# EAGLE board HDMI_RGB_LVDS_fertig_V4 (EAGLE 6.3)
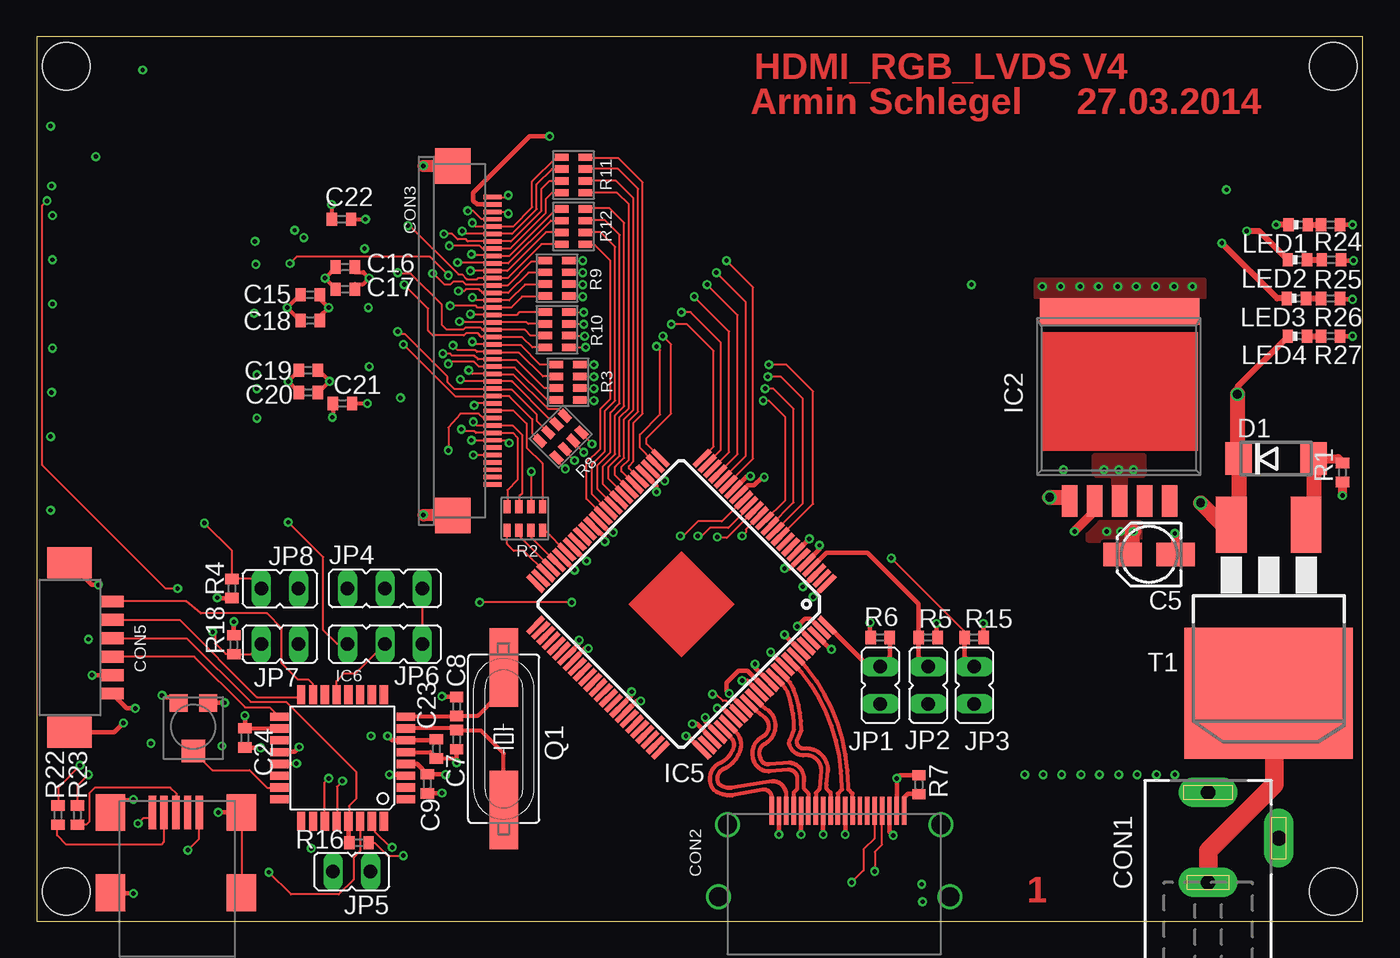
[diagram p6: board, top side]
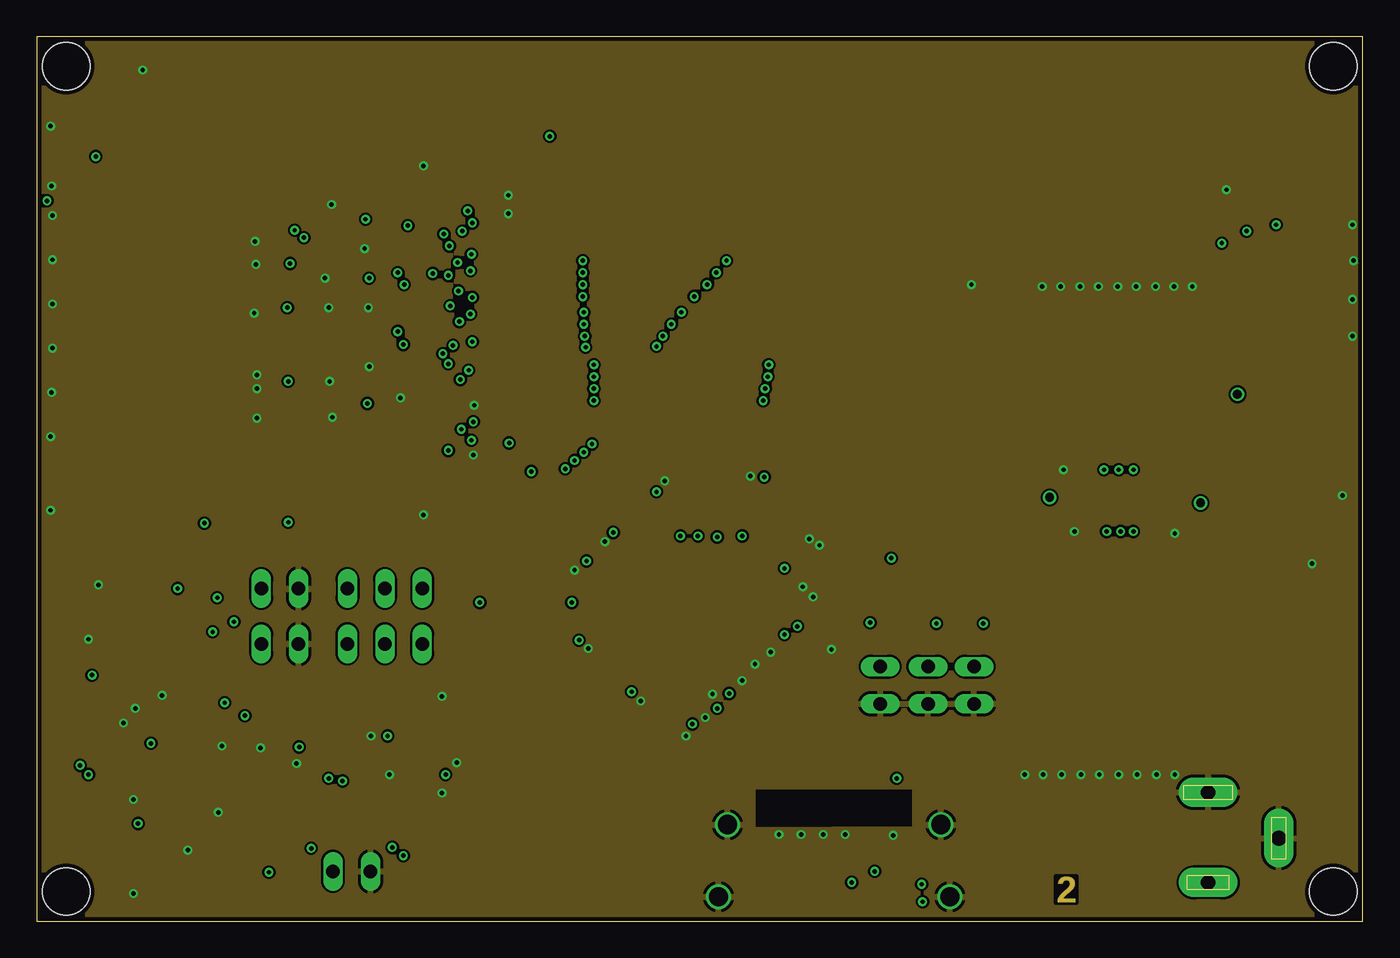
[diagram p7: board, inner layer Route2]
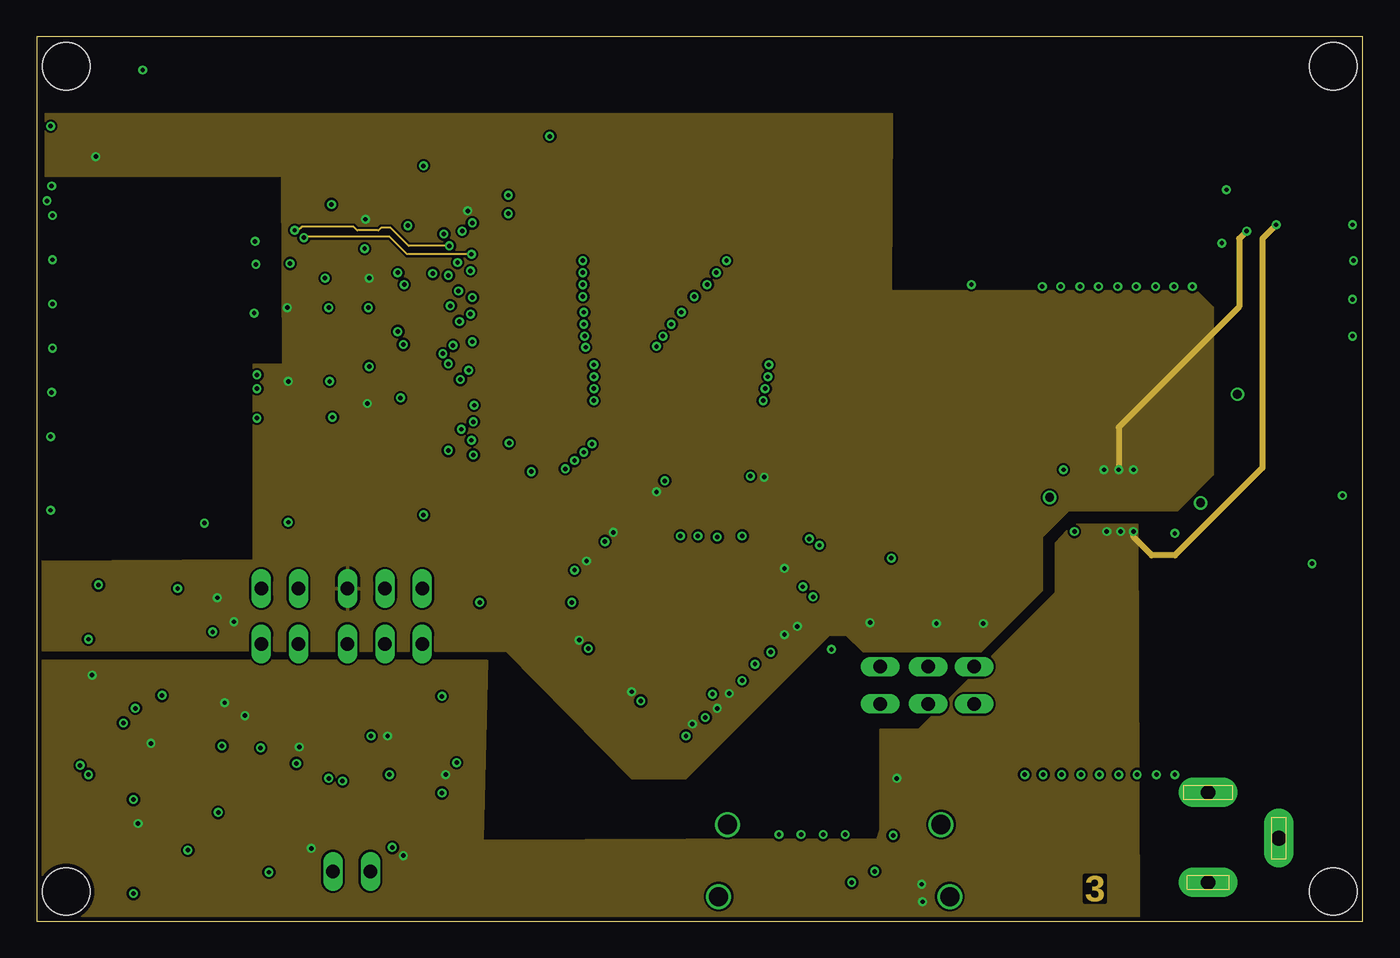
[diagram p8: board, inner layer Route15]
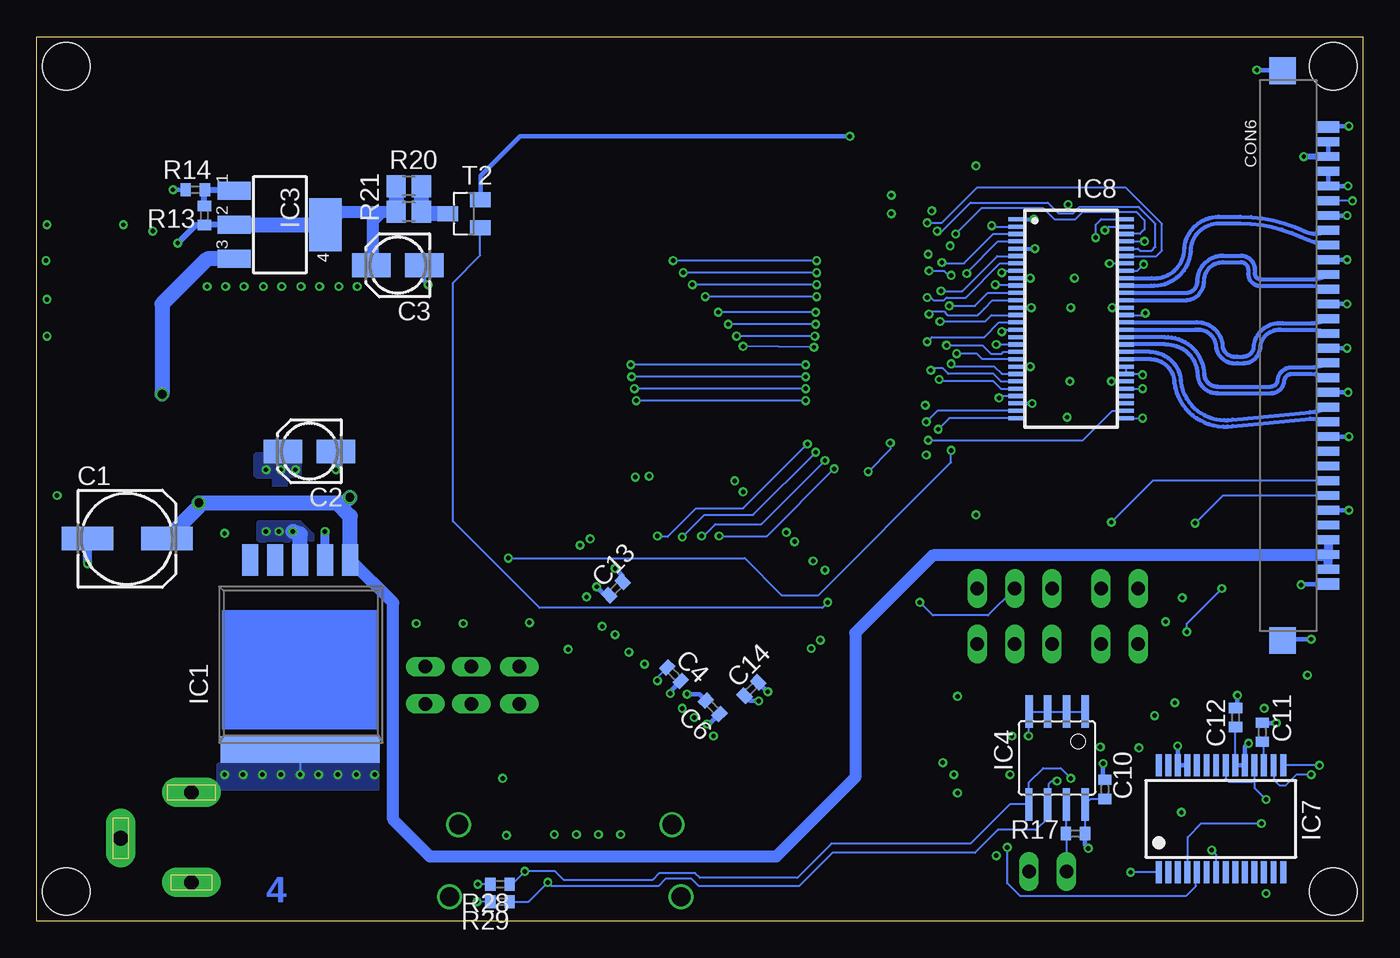
[diagram p9: board, bottom side, seen from below]

Size 90 x 60 mm. Coordinates in mm from the lower left corner, seen from the top.
Outline: 0,0 90,0 90,60 0,60 0,0
Copper layers (1+2*15+16): Top 0.035mm / dielectric 0.38mm / Route2 0.035mm / dielectric 0.71mm / Route15 0.035mm / dielectric 0.38mm / Bottom 0.035mm
Design rules "PCB-POOL Standard_ML4": minimum track width 0.15mm, minimum drill 0.3mm, track to track 0.15mm, track to pad 0.15mm, pad to pad 0.15mm, via to via 0.15mm, smd to smd 0.15mm, copper to edge 0.3mm, drill to drill 0.2mm, minimum pad ring 0.2mm, minimum via ring 0.15mm, stop-mask expansion 0.075mm, vias tented up to drill 0mil, thermal gap 0.2mm
Holes 3.2 mm at 2,2 2,58 88,58 88,2

## Footprints (pad centres in the part's own frame; a part is rotated, then mirrored left to right if it is on the bottom)
C_POL_6X6MM = smd 3.5 x 1.6: + 2.7,0.07; - -2.7,0.07
C_POL_4X4MM = smd 2.6 x 1.6: + 1.8,0; - -1.8,0
C0402 = smd 0.7 x 0.9: 1 -0.65,0; 2 0.65,0
KLDX-0202-A-LT = drill 1 pad 2 long: 1 3.1,-0.01; 2 0,-4.81; 3 -3,-0.01
FCI-10029449-111RLF = smd 0.3 x 1.9: 1 -4.25,1; 2 -3.75,1; 3 -3.25,1; 4 -2.75,1; 5 -2.25,1; 6 -1.75,1; 7 -1.25,1; 8 -0.75,1; 9 -0.25,1; 10 0.25,1; 11 0.75,1; 12 1.25,1; 13 1.75,1; 14 2.25,1; 15 2.75,1; 16 3.25,1; 17 3.75,1; 18 4.25,1; 19 4.75,1 | drill 1.3: GND@1 -7.25,0.05; GND@2 -7.85,-4.85; GND@3 7.25,0.05; GND@4 7.85,-4.85
XF2M-4015-1A = smd 0.3 x 1.2: 1 -9.75,2.5; 2 -9.25,2.5; 3 -8.75,2.5; 4 -8.25,2.5; 5 -7.75,2.5; 6 -7.25,2.5; 7 -6.75,2.5; 8 -6.25,2.5; 9 -5.75,2.5; 10 -5.25,2.5; 11 -4.75,2.5; 12 -4.25,2.5; 13 -3.75,2.5; 14 -3.25,2.5; 15 -2.75,2.5; 16 -2.25,2.5; 17 -1.75,2.5; 18 -1.25,2.5; 19 -0.75,2.5; 20 -0.25,2.5; 21 0.25,2.5; 22 0.75,2.5; 23 1.25,2.5; 24 1.75,2.5; 25 2.25,2.5; 26 2.75,2.5; 27 3.25,2.5; 28 3.75,2.5; 29 4.25,2.5; 30 4.75,2.5; 31 5.25,2.5; 32 5.75,2.5; 33 6.25,2.5; 34 6.75,2.5; 35 7.25,2.5; 36 7.75,2.5; 37 8.25,2.5; 38 8.75,2.5; 39 9.25,2.5; 40 9.75,2.5 | smd 2.4 x 2.4: GND@1 -11.85,-0.2; GND@2 11.85,-0.2
FCI-10033526-N3212LF = smd 0.5 x 2.25: 1 -1.6,0.8; 2 -0.8,0.8; 3 0,0.8; 4 0.8,0.8; 5 1.6,0.8 | smd 2 x 2.5: GND@1 -4.45,0.8; GND@2 -4.45,-4.65; GND@3 4.45,-4.65; GND@4 4.45,0.8
MOLEX-53261-0671 = smd 0.8 x 1.6: 1 -3.125,2.55; 2 -1.875,2.55; 3 -0.625,2.55; 4 0.625,2.55; 5 1.875,2.55; 6 3.125,2.55 | smd 2.1 x 3: GND@1 -5.75,-0.35; GND@2 5.75,-0.35
FI-X30SSLA-HF = smd 0.6 x 1.5: 1 -14.5,2.65; 2 -13.5,2.65; 3 -12.5,2.65; 4 -11.5,2.65; 5 -10.5,2.65; 6 -9.5,2.65; 7 -8.5,2.65; 8 -7.5,2.65; 9 -6.5,2.65; 10 -5.5,2.65; 11 -4.5,2.65; 12 -3.5,2.65; 13 -2.5,2.65; 14 -1.5,2.65; 15 -0.5,2.65; 16 0.5,2.65; 17 1.5,2.65; 18 2.5,2.65; 19 3.5,2.65; 20 4.5,2.65; 21 5.5,2.65; 22 6.5,2.65; 23 7.5,2.65; 24 8.5,2.65; 25 9.5,2.65; 26 10.5,2.65; 27 11.5,2.65; 28 12.5,2.65; 29 13.5,2.65; 30 14.5,2.65 | smd 0.8 x 1.5: GND@1 -15.5,2.65; GND@2 15.5,2.65 | smd 1.8 x 1.8: GND@3 -19.325,-0.45; GND@4 19.325,-0.45
DO214A = smd 1.8 x 2.2: A 2.55,0; C -2.55,0
TO263-5 = smd 1.07 x 2.16: 1 3.4,7; 2 1.7,7; 3 0,7; 4 -1.7,7; 5 -3.4,7 | smd 10.8 x 1.8: 6 0,-5.87
SOT223 = smd 1.219 x 2.235: 1 -2.311,-3.099; 2 0,-3.099; 3 2.311,-3.099 | smd 3.6 x 2.2: 4 0,3.099
SOIC8 = smd 0.5 x 2.2: 1 -1.905,-3.154; 2 -0.645,-3.154; 3 0.625,-3.154; 4 1.895,-3.154; 5 1.905,3.154; 6 0.635,3.154; 7 -0.635,3.154; 8 -1.905,3.154
HTQFP-100 = smd 1.5 x 0.35: 1 -8,6; 2 -8,5.5; 3 -8,5; 4 -8,4.5; 5 -8,4; 6 -8,3.5; 7 -8,3; 8 -8,2.5; 9 -8,2; 10 -8,1.5; 11 -8,1; 12 -8,0.5; 13 -8,0; 14 -8,-0.5; 15 -8,-1; 16 -8,-1.5; 17 -8,-2; 18 -8,-2.5; 19 -8,-3; 20 -8,-3.5; 21 -8,-4; 22 -8,-4.5; 23 -8,-5; 24 -8,-5.5; 25 -8,-6; 51 8,-6; 52 8,-5.5; 53 8,-5; 54 8,-4.5; 55 8,-4; 56 8,-3.5; 57 8,-3; 58 8,-2.5; 59 8,-2; 60 8,-1.5; 61 8,-1; 62 8,-0.5; 63 8,0; 64 8,0.5; 65 8,1; 66 8,1.5; 67 8,2; 68 8,2.5; 69 8,3; 70 8,3.5; 71 8,4; 72 8,4.5; 73 8,5; 74 8,5.5; 75 8,6 | smd 0.35 x 1.5: 26 -6,-8; 27 -5.5,-8; 28 -5,-8; 29 -4.5,-8; 30 -4,-8; 31 -3.5,-8; 32 -3,-8; 33 -2.5,-8; 34 -2,-8; 35 -1.5,-8; 36 -1,-8; 37 -0.5,-8; 38 0,-8; 39 0.5,-8; 40 1,-8; 41 1.5,-8; 42 2,-8; 43 2.5,-8; 44 3,-8; 45 3.5,-8; 46 4,-8; 47 4.5,-8; 48 5,-8; 49 5.5,-8; 50 6,-8; 76 6,8; 77 5.5,8; 78 5,8; 79 4.5,8; 80 4,8; 81 3.5,8; 82 3,8; 83 2.5,8; 84 2,8; 85 1.5,8; 86 1,8; 87 0.5,8; 88 0,8; 89 -0.5,8; 90 -1,8; 91 -1.5,8; 92 -2,8; 93 -2.5,8; 94 -3,8; 95 -3.5,8; 96 -4,8; 97 -4.5,8; 98 -5,8; 99 -5.5,8; 100 -6,8
TQFP32 = smd 1.27 x 0.559: 1 -4.293,2.8; 2 -4.293,2; 3 -4.293,1.2; 4 -4.293,0.4; 5 -4.293,-0.4; 6 -4.293,-1.2; 7 -4.293,-2; 8 -4.293,-2.8; 17 4.293,-2.8; 18 4.293,-2; 19 4.293,-1.2; 20 4.293,-0.4; 21 4.293,0.4; 22 4.293,1.2; 23 4.293,2; 24 4.293,2.8 | smd 0.559 x 1.27: 9 -2.8,-4.293; 10 -2,-4.293; 11 -1.2,-4.293; 12 -0.4,-4.293; 13 0.4,-4.293; 14 1.2,-4.293; 15 2,-4.293; 16 2.8,-4.293; 25 2.8,4.293; 26 2,4.293; 27 1.2,4.293; 28 0.4,4.293; 29 -0.4,4.293; 30 -1.2,4.293; 31 -2,4.293; 32 -2.8,4.293
SSOP28 = smd 0.4 x 1.5: 1 -4.225,-3.625; 2 -3.575,-3.625; 3 -2.925,-3.625; 4 -2.275,-3.625; 5 -1.625,-3.625; 6 -0.975,-3.625; 7 -0.325,-3.625; 8 0.325,-3.625; 9 0.975,-3.625; 10 1.625,-3.625; 11 2.275,-3.625; 12 2.925,-3.625; 13 3.575,-3.625; 14 4.225,-3.625; 15 4.225,3.625; 16 3.575,3.625; 17 2.925,3.625; 18 2.275,3.625; 19 1.625,3.625; 20 0.975,3.625; 21 0.325,3.625; 22 -0.325,3.625; 23 -0.975,3.625; 24 -1.625,3.625; 25 -2.275,3.625; 26 -2.925,3.625; 27 -3.575,3.625; 28 -4.225,3.625
TSSOP-56 = smd 0.28 x 1: 1 -6.75,-3.85; 2 -6.25,-3.85; 3 -5.75,-3.85; 4 -5.25,-3.85; 5 -4.75,-3.85; 6 -4.25,-3.85; 7 -3.75,-3.85; 8 -3.25,-3.85; 9 -2.75,-3.85; 10 -2.25,-3.85; 11 -1.75,-3.85; 12 -1.25,-3.85; 13 -0.75,-3.85; 14 -0.25,-3.85; 15 0.25,-3.85; 16 0.75,-3.85; 17 1.25,-3.85; 18 1.75,-3.85; 19 2.25,-3.85; 20 2.75,-3.85; 21 3.25,-3.85; 22 3.75,-3.85; 23 4.25,-3.85; 24 4.75,-3.85; 25 5.25,-3.85; 26 5.75,-3.85; 27 6.25,-3.85; 28 6.75,-3.85; 29 6.75,3.65; 30 6.25,3.65; 31 5.75,3.65; 32 5.25,3.65; 33 4.75,3.65; 34 4.25,3.65; 35 3.75,3.65; 36 3.25,3.65; 37 2.75,3.65; 38 2.25,3.65; 39 1.75,3.65; 40 1.25,3.65; 41 0.75,3.65; 42 0.25,3.65; 43 -0.25,3.65; 44 -0.75,3.65; 45 -1.25,3.65; 46 -1.75,3.65; 47 -2.25,3.65; 48 -2.75,3.65; 49 -3.25,3.65; 50 -3.75,3.65; 51 -4.25,3.65; 52 -4.75,3.65; 53 -5.25,3.65; 54 -5.75,3.65; 55 -6.25,3.65; 56 -6.75,3.65
JUMPER2_THROUGHHOLE = drill 0.914 long: 1 0,-1.27; 2 0,1.27
JUMPER3_THROUGHHOLE = drill 0.914 long: 1 0,-2.54; 2 0,0; 3 0,2.54
LED0402 = smd 0.7 x 0.9: A -0.65,0; C 0.65,0
HC49/USSM = smd 5.334 x 1.93: 1 -4.826,0; 2 4.826,0
R0402 = smd 0.7 x 0.9: 1 -0.65,0; 2 0.65,0
R-ARRAY-4X0603 = smd 0.9 x 0.5: 1M -0.8,1.2; 1P 0.8,1.2; 2M -0.8,0.4; 2P 0.8,0.4; 3M -0.8,-0.4; 3P 0.8,-0.4; 4M -0.8,-1.2; 4P 0.8,-1.2
35WR5KLFTR = smd 1.2 x 1.2: 1 -1.6,1; 3 -1.6,-1 | smd 1.5 x 1.6: 2 1.65,0
R2512 = smd 1.3 x 1.5: 1 -0.85,0; 2 0.85,0
D2PAK = smd 2.083 x 3.81: 1 -2.54,-8.89; 3 2.54,-8.89 | smd 11.43 x 8.89: 2 0,2.54
SOT23 = smd 1 x 1.4: 1 -0.95,-1.1; 2 0.95,-1.1; 3 0,1.1

## Placement (x,y rotation side)
C1  100u  [C_POL_6X6MM]  83.88,25.88 0 bottom
C2  10u  [C_POL_4X4MM]  71.5,31.88 180 bottom
C3  10u  [C_POL_4X4MM]  65.5,44.5 180 bottom
C4  100n  [C0402]  46.75,16.75 315 bottom
C5  10u  [C_POL_4X4MM]  75.5,24.88 180 top
C6  100n  [C0402]  44.12,14.5 315 bottom
C7  22p  [C0402]  28.5,12.31 90 top
C8  22p  [C0402]  28.5,14.56 270 top
C9  100n  [C0402]  26.5,9.31 270 top
C10  100n  [C0402]  17.5,8.94 270 bottom
C11  100n  [C0402]  6.81,12.81 90 bottom
C12  100n  [C0402]  8.62,13.81 90 bottom
C13  100n  [C0402]  50.69,22.56 45 bottom
C14  100n  [C0402]  41.5,15.75 45 bottom
C15  0.01u  [C0402]  18.56,42.5 180 top
C16  0.1u  [C0402]  20.94,44.38 0 top
C17  0.01u  [C0402]  20.94,42.88 0 top
C18  0.1u  [C0402]  18.56,40.75 180 top
C19  0.01u  [C0402]  18.44,37.38 180 top
C20  0.1u  [C0402]  18.44,35.88 180 top
C21  0.01u  [C0402]  20.75,35.12 0 top
C22  0.01u  [C0402]  20.69,47.62 0 top
C23  100n  [C0402]  27.12,11.69 270 top
C24  100n  [C0402]  14.12,12.44 270 top
CON1  KLDX-0202-A-LT  [KLDX-0202-A-LT]  79.5,5.62 90 top
CON2  FCI-10029449-111RLF  [FCI-10029449-111RLF]  54.12,6.5 0 top
CON3  XF2M-4015-1A  [XF2M-4015-1A]  28.44,39.38 270 top
CON4  FCI-10033526-N3212LF  [FCI-10033526-N3212LF]  9.44,6.56 0 top
CON5  MOLEX-53261-0671  [MOLEX-53261-0671]  2.56,18.56 270 top
CON6  FI-X30SSLA-HF  [FI-X30SSLA-HF]  5,38.38 270 bottom
D1  BZG03C15TR3  [DO214A]  84.12,31.38 0 top
IC1  WPMDL1300501BD  [TO263-5]  72.12,17.5 0 bottom
IC2  WPMDL1300331BD  [TO263-5]  73.5,35.5 180 top
IC3  TLV1117CDCYR  [SOT223]  73.5,47.25 270 bottom
IC4  AT24C01C-SSHM-B  [SOIC8]  20.75,11.06 180 bottom
IC5  TFP401APZP  [HTQFP-100]  43.75,21.5 225 top
IC6  ATMEGA48A-AU  [TQFP32]  20.75,11.06 180 top
IC7  FT232RL  [SSOP28]  9.62,6.94 0 bottom
IC8  SN75LVDS83BDGGR  [TSSOP-56]  19.69,40.88 270 bottom
JP1  JUMPER2  [JUMPER2_THROUGHHOLE]  57.25,16 0 top
JP2  JUMPER2  [JUMPER2_THROUGHHOLE]  60.5,16 0 top
JP3  JUMPER2  [JUMPER2_THROUGHHOLE]  63.62,16 0 top
JP4  JUMPER3  [JUMPER3_THROUGHHOLE]  23.62,22.56 270 top
JP5  [JUMPER2_THROUGHHOLE]  21.38,3.38 90 top
JP6  JUMPER3  [JUMPER3_THROUGHHOLE]  23.62,18.81 90 top
JP7  [JUMPER2_THROUGHHOLE]  16.5,18.81 90 top
JP8  [JUMPER2_THROUGHHOLE]  16.5,22.56 90 top
LED1  [LED0402]  85.62,47.25 180 top
LED2  [LED0402]  85.56,44.88 180 top
LED3  [LED0402]  85.5,42.25 180 top
LED4  [LED0402]  85.56,39.69 180 top
Q1  ATS073ASM-1  [HC49/USSM]  31.69,12.38 270 top
R1  100k  [R0402]  88.62,30.44 90 top
R2  22R  [R-ARRAY-4X0603]  33.12,27.31 90 top
R3  22R  [R-ARRAY-4X0603]  36.06,36.56 180 top
R4  10k  [R0402]  13.25,22.56 270 top
R5  10k  [R0402]  60.5,19.25 0 top
R6  10k  [R0402]  57.25,19.25 180 top
R7  100R  [R0402]  59.88,9.25 90 top
R8  22R  [R-ARRAY-4X0603]  35.56,32.88 135 top
R9  22R  [R-ARRAY-4X0603]  35.31,43.62 180 top
R10  22R  [R-ARRAY-4X0603]  35.31,40.12 180 top
R11  22R  [R-ARRAY-4X0603]  36.44,50.62 180 top
R12  22R  [R-ARRAY-4X0603]  36.44,47.12 180 top
R13  4k7  [R0402]  78.62,47.88 270 bottom
R14  31k4  [R0402]  79.25,49.62 180 bottom
R15  10k  [R0402]  63.62,19.25 0 top
R16  10k  [R0402]  21.88,5.31 180 top
R17  10k  [R0402]  19.5,5.94 0 bottom
R18  10k  [R0402]  13.38,18.75 90 top
R19  10k  [35WR5KLFTR]  10.62,13.19 270 top
R20  140R  [R2512]  64.75,49.88 180 bottom
R21  140R  [R2512]  64.75,48.12 180 bottom
R22  0R  [R0402]  1.44,7.19 90 top
R23  0R  [R0402]  2.75,7.19 90 top
R24  261R  [R0402]  87.81,47.25 180 top
R25  600R  [R0402]  87.88,44.88 180 top
R26  1k5  [R0402]  87.81,42.25 180 top
R27  2k5  [R0402]  87.81,39.69 180 top
R28  10k  [R0402]  58.56,2.5 180 bottom
R29  10k  [R0402]  58.56,1.31 180 bottom
T1  IRF9530NSTRRPBF  [D2PAK]  83.62,18 180 top
T2  IRLML2502TRPBF  [SOT23]  61,48 90 bottom
U$1  FRAME_A3_LANDSCAPE  [FRAME]  0.05,0.06 0 top
U$2  FRAME_A3_LANDSCAPE  [FRAME]  0,0 0 top
U$3  FRAME_A3_LANDSCAPE  [FRAME]  0,0 0 top
U$4  FRAME_A3_LANDSCAPE  [FRAME]  0,0 0 top
U$5  FRAME_A3_LANDSCAPE  [FRAME]  0,0 0 top
U$15  FRAME_A3_LANDSCAPE  [FRAME]  0,0 0 top

## Tracks (layer width: path | path; a pad name or v marks a point on that pad's centre or on a via)
+3V3  (via drill 0.3)
  Top 0.15: C16.2 21.59,44.04 | C17.2 21.59,43.21 | IC5.78 | IC5.67 39.51,14.45 | IC5.57 35.97,17.97 | IC5.29 | IC5.18 47.61,28.93 | IC5.6 | IC5.97 | IC5.95 | IC5.88 49.41,15.91 | R6.2 56.56,19.29 | R5.2 61.06,19.34 | R15.2 64.25,19.27 | CON3.4 30.19,47.62 29.62,48.19 v29.25,48.19 | IC5.38
  Top 0.28: C20.2 17.79,35.9 v17.06,36.62 17.79,37.35 C19.2 | 21.59,44.04 22.15,44.04 v22.56,43.62 22.15,43.21 21.59,43.21 | C15.2 17.88,42.5 v17,41.62 17.88,40.75 C18.2 | C21.2 v22.44,35.12 | C22.2 v22.31,47.62
  Top 0.3: IC5.95 50.76,19.44 v50.75,19.44 | IC5.97 v51.62,20 52.12,20.5 52.53,20.5 IC5.99 | IC5.88 48.25,17 47.62,17 46.81,16.19 46.81,15.62 v47,15.44 47.99,14.45 IC5.84 | IC5.82 46.57,14.44 v46.19,14.44 | IC5.43 37.28,24.44 v37.31,24.44 | IC5.38 38.88,26.38 v39.12,26.38 | IC5.29 42.06,29.55 v42.06,29.12 | IC5.18 48.28,29.56 48.69,29.56 49.25,30.12 v49.38,30.12 | IC5.6 51.14,23.94 v50.75,23.94 | 35.97,17.97 36.81,18.81 v36.81,19.06 | 56.56,19.29 v56.56,20.25 | 61.06,19.34 v61.06,20.19 | 64.25,19.27 v64.25,20.19 | R4.2 12.28,21.91 v12.25,21.94 | R18.2 v13.38,20.31
  Top 0.305: 39.51,14.45 40.38,15.31 v40.38,15.56 | IC5.78 44.8,13.38 v44.5,13.38
  Top 0.406: LED2.C 82.97,46.81 v82.12,46.81
  Top 0.61: 73.31,28.69 IC2.3
  Route15 0.406: v82.12,46.81 81.62,46.31 81.62,41.69 73.44,33.5 v73.44,30.62
  Bottom 0.15: C13.2 50.23,23.41
  Bottom 0.28: IC8.34 v17.06,36.62 | IC8.9 v22.56,43.62 | IC8.26 v22.44,35.12 | IC8.1 v22.31,47.62
  Bottom 0.3: CON6.1 CON6.2 | 50.23,23.41 v50.75,23.94 | IC8.44 v17,41.62 | 46.29,16.15 C4.2 47,15.58 v47,15.44
  Bottom 0.305: C14.2 40.39,15.56 v40.38,15.56 | C6.2 44.33,13.38 v44.5,13.38
  Bottom 0.406: CON6.2 v4,51.88
  other vias: 74.44,30.62 72.44,30.62
  pour Route15: 16.62,50.56 16.69,37.75 14.69,37.75 14.69,24.5 0.25,24.38 0.38,18.38 31.88,18.31 40.38,9.69 44.06,9.69 53.81,19.44 54.94,19.44 56.06,18.31 64.12,18.31 68.25,22.44 68.25,26.06 70.06,27.88 77.44,27.88 79.88,30.31 79.88,41.62 78.75,42.75 58,42.75 58.06,54.75 0.56,54.75 0.56,50.56
  pour Top (no thermals): 73,29.56 73,30 72.88,30.12 71.88,30.12 71.69,30.31 71.69,31.62 71.81,31.75 75.12,31.75 75.25,31.62 75.25,30.25 75.12,30.12 74.06,30.12 74,30.06 74,29.56
  pour Bottom (no thermals): 73,29.56 73,30 72.88,30.12 72.19,30.19 72.06,30.31 72.06,31.62 72.19,31.75 75.12,31.75 75.25,31.62 75.25,30.25 75.12,30.12 74.06,30.12 74,30.06 74,29.56
+5V  (via drill 0.3)
  Top 0.15: IC6.20 16.42,11.5 | CON4.1 7.78,6.96 7.21,6.96 v6.88,6.62 | R16.1 22.94,5.31 23.81,4.44 v24.88,4.44 | 25.07,10.69 IC6.4 | 25.09,12.31 IC6.6 | 25.14,12.36 IC6.6 | 27.1,12.36 C23.1 27.07,12.39 26.95,12.26 | IC6.6 24.99,12.31
  Top 0.28: IC6.18 14.15,13.06 C24.1
  Top 0.3: 16.42,11.5 17.5,11.5 v17.81,11.81 | C24.1 v14.12,13.94 | v12.75,14.81 11.65,14.81 R19.1 | CON2.18 v58.38,9.69 58.59,9.9 R7.2
  Top 0.305: CON5.5 v3.75,16.69 | v23.81,12.56 24.11,12.26 IC6.6 27.05,12.26 C23.1 | v27.75,9.94 27.73,9.96 C9.1 25.8,10.66 IC6.4
  Top 0.406: C5.+ 73.88,24.88 74.38,25.38 | LED1.C v84.12,47.25
  Top 1.016: 74.38,25.38 74.38,26.44 v74.44,26.44
  Route15 0.406: v84.12,47.25 83.19,46.31 83.19,30.75 77.25,24.81 75.69,24.81 74.44,26.06 v74.44,26.44
  Bottom 0.15: IC7.4 11.88,3.34 11.88,5.69 10.94,6.62 v6.88,6.62 | IC7.20 8.65,13.14 C12.1 | IC4.8 18.47,8.29 C10.2 | 18.81,8.69 18.84,8.65 IC4.8 | IC4.8 R17.2 | R28.2 v60.06,2.5 | R29.2 v60.12,1.31
  Bottom 0.3: v7.75,12.06 8,11.81 IC7.19 IC7.20 | v18.62,4.94 18.85,5.16 R17.2
  Bottom 1.016: IC1.3 72.12,26.25 v72.62,26.44
  other vias: 73.56,26.44
  pour Route15: 0,0 0.38,17.69 30.56,17.69 30.25,5.5 44.12,5.56 57.06,5.56 57.25,6.19 57.25,13 59.88,13 69.19,22.31 69.19,25.69 70.31,26.94 74.69,26.94 74.81,0.06 73.81,0.12 44.19,0
  pour Top: 72.19,27 71.38,26.19 71.38,25.88 74.88,25.88 74.88,27
  pour Bottom: 72.19,27 71.38,26.19 71.38,25.88 74.88,25.88 74.88,27
+9V6  (via drill 0.3)
  Top 0.406: LED3.C 84.19,42.25 v80.44,46
  Bottom 0.406: IC3.2 78.6,47.25 R13.2 79.21,47.23 v80.44,46
  Bottom 0.813: 69.53,48.12 66.56,48.12 | 66.56,48.12 R21.2 | 67.17,44.62 67.17,47.51 66.56,48.12
  Bottom 1.016: IC3.2 IC3.4 69.53,48.12 | R20.2 R21.2 | 67.17,44.62 C3.+
+12V  (via drill 0.6)
  Top 0.406: LED4.C 84.91,39.66 81.5,36.25 v81.5,35.75
  Top 1.016: v81.5,35.75 81.5,31.45 D1.C 81.58,27.38 T1.3 80.48,26.89 v79,28.38 | v68.75,28.75 69.85,28.75 IC2.1
  Bottom 0.15: CON6.29 2.38,24.85 2.38,24.81
  Bottom 0.61: CON6.28 CON6.29 CON6.30
  Bottom 0.813: 2.35,24.77 2.31,24.81 2.38,24.81 29.19,24.81 34.44,19.56 34.44,9.75 39.81,4.38 63.31,4.38 65.81,6.88 65.81,21.59 IC1.1 68.6,24.62
  Bottom 1.016: C1.+ 79,28.12 v79,28.38 69.62,28.38 | IC1.1 68.72,27.48 69.62,28.38 | 69.62,28.38 69.12,28.38 v68.75,28.75 | IC3.3 78.44,44.94 81.5,41.88 v81.5,35.75
AVR_!RESET
  Top 0.15: CON5.3 10.19,19.19 14.5,14.88 16.94,14.88 21.69,10.12 21.69,8.31 21.19,7.81 21.19,6.81 IC6.29
  Top 0.3: IC6.29 21.15,5.39 R16.2
AVR_MISO
  Top 0.15: CON5.2 9.69,20.44 14.94,15.19 17.78,15.19 IC6.16
AVR_MOSI
  Top 0.15: IC6.15 18.75,16.06 18.44,16.38 17.75,16.38 16.62,17.5 16.62,19.88 15.62,20.88 11.12,20.88 10.12,21.69 CON5.1
AVR_PWM
  Top 0.15: IC6.13 20.35,16.29 20.88,16.81 21.62,16.81 JP6.2
AVR_PWM_ADC
  Top 0.15: R19.2 11.91,10.25 14.44,10.25 15.62,9.06 IC6.23
AVR_SCK
  Top 0.15: 16.45,13.88 IC6.17 15.81,14.5 14.12,14.5 10.69,17.94 CON5.4
AVR_XTAL1
  Top 0.15: 25.14,12.96 IC6.7 | 28.52,12.94 C7.2
  Top 0.28: 28.52,12.94 30.12,12.94 31.69,11.38 Q1.2 | 25.14,12.96 25.27,12.96 25.44,13.12 28.34,13.12 C7.2
AVR_XTAL2
  Top 0.15: 25.09,13.91 IC6.8 | 28.52,13.94 C8.2
  Top 0.28: 28.52,13.94 29.94,13.94 31.19,15.19 31.19,16.7 Q1.1 | 25.09,13.91 C8.2
EDID_SCL  (via drill 0.3)
  Top 0.15: IC6.28 20.38,6.79 20.38,9.12 v20.75,9.5 | CON2.15 56.88,5.62 56.12,4.88 56.12,3.44 v55.31,2.62
  Bottom 0.15: v20.75,9.5 21.12,9.5 21.31,9.31 21.31,8.69 21.39,8.62 IC4.6 21.39,6.99 22.19,6.19 24.75,6.19 26.31,4.62 36,4.62 38.25,2.38 45.06,2.38 45.56,2.88 47.31,2.88 47.81,2.38 55.06,2.38 v55.31,2.62 56.62,1.31 R29.1
EDID_SDA  (via drill 0.3)
  Top 0.15: IC6.27 19.55,9.43 v19.81,9.69 | CON2.16 57.38,5.19 56.88,4.69 v56.88,3.38
  Bottom 0.15: 22.69,7.94 22.69,9.38 21.69,10.38 20.5,10.38 v19.81,9.69 | 22.69,7.94 IC4.5 | 22.69,7.94 23.93,7.94 26.62,5.25 36.06,5.25 38.38,2.94 45,2.94 45.31,3.25 47.75,3.25 48.19,2.81 54.25,2.81 54.81,3.38 v56.88,3.38 57.75,2.5 R28.1
EDID_WP
  Bottom 0.15: IC4.7 20.11,5.97 R17.1 20.11,5.89 JP5.2
FTDI_3V3OUT
  Bottom 0.15: IC7.17 6.7,12.09 C11.1
FTDI_RXD  (via drill 0.3)
  Top 0.15: IC6.31 22.75,6.38 22.94,6.19 22.94,6.06 24,5 v24.12,5
  Bottom 0.15: v24.12,5 24.12,2.56 23.25,1.69 12,1.69 11.31,2.38 11.31,3.25 IC7.5
FTDI_TXD  (via drill 0.3)
  Top 0.15: IC6.30 21.95,4.76 21.5,4.31 21.5,2.81 20.5,1.81 17.25,1.81 v15.75,3.31
  Bottom 0.15: IC7.1 v15.75,3.31
GND  (via drill 0.3)
  Top 0.15: IC6.5 25.02,11.44 | IC6.21 16.48,10.69 | IC6.3 24.97,9.94 | C9.2 26.52,8.69 | CON5.6 5,15.32 | R19.3 9.22,15.19 | CON4.5 10.97,6.66 10.97,5.54 v10.25,4.81 | CON4.GND@2 5.84,1.88 | CON4.GND@3 13.94,2.9 13.94,6.85 CON4.GND@4 | C15.1 19.21,42.23 | C18.1 19.21,41.02 | C20.1 19.12,35.88 | C19.1 19.12,37.38 | C16.1 20.29,44.35 | C17.1 20.29,42.9 | IC5.87 49.05,15.51 | IC5.79 | IC5.68 39.89,14.07 | IC5.45 | IC5.39 37.76,26.8 | IC5.28 | IC5.19 47.22,29.28 | 52.23,24.3 IC5.5 52.27,24.33 | IC5.7 | IC5.3 | IC5.1 | IC5.89 49.74,16.2 | IC5.92 50.8,17.26 | IC5.83 47.67,14.07 46.81,14.94 46.56,14.94 46.1,15.4 v45.87,15.4 | CON3.36 v29.62,31.62 | CON3.3 31.88,48.12 v32,48 | CON3.1 31.88,49.12 v32,49.25 | v6.56,8.25 5.88,8.25 CON4.GND@1 | CON3.29 29.81,35.12 v29.69,35 | 3.71,22.81 3.69,22.81
  Top 0.28: 19.12,37.38 v19.88,36.62 19.12,35.88 | 20.29,44.35 v19.56,43.62 20.29,42.9 | 19.21,42.23 v19.81,41.62 19.21,41.02 | C21.1 20.1,34.23 v20.06,34.19 | C22.1 20.04,48.59 v20,48.62 | IC6.5 26.7,11.46 C23.2 28.21,11.04 v28.5,10.75
  Top 0.3: 49.05,15.51 48.25,16.31 v47.88,16.31 | 49.74,16.2 48.75,17.19 v48.75,17.44 | 50.8,17.26 v49.81,18.25 | IC5.98 53.88,18.44 v53.94,18.44 | IC5.45 v36.5,23.81 | 37.76,26.8 38.56,26 v38.56,25.75 | IC5.28 42.45,29.88 v42.62,29.88 | IC5.19 48.2,30.19 v48.44,30.19 | IC5.7 v52.44,25.94 | IC5.5 53.12,25.22 v53.12,25.5 | IC5.1 52.73,22 v52.69,22 | IC5.3 v52,22.69 | IC5.58 37.21,18.5 v37.44,18.5 | 16.48,10.69 v17.62,10.69 | C24.2 14.16,11.75 v15.19,11.75 | v6.69,14.44 6.11,14.44 CON5.6 | CON5.GND@2 5.25,12.81 v5.88,13.44 | 9.22,15.19 8.62,15.19 v8.5,15.31 | CON2.2 v50.38,5.88 | CON2.5 v51.88,5.88 | CON2.8 v53.38,5.88 | CON2.11 v54.88,5.88 | CON2.17 57.88,6.06 v58.12,5.81 | R24.1 v89.31,47.25 | R25.1 88.59,44.81 v89.38,44.81 | R26.1 88.53,42.19 v89.31,42.19 | R27.1 v89.31,39.69
  Top 0.305: CON5.GND@1 3.71,22.81 v4.19,22.81 | CON4.GND@4 13.88,7.38 v12.31,7.38 | 5.84,1.88 v6.56,1.88 | 24.97,9.94 v23.94,9.94 | C7.1 v28.5,10.75 | 26.52,8.69 v27.5,8.69 | C8.1 27.54,15.21 v27.5,15.25 | 39.89,14.07 40.75,14.94 v41,14.94 | IC5.76 44.21,12.55 v44.06,12.55 | IC5.79 45.38,13.51 v45.38,13.81
  Top 0.6: R1.1 v88.62,28.88
  Top 0.61: C5.- 77.3,26.26 v77.25,26.31 | IC2.2 71.8,27.8 v70.44,26.44
  Top 0.813: CON3.GND@1 26.27,51.23 v26.25,51.25 | CON3.GND@2 26.29,27.52 v26.25,27.56
  Bottom 0.15: v22.69,12.56 22.69,14.17 IC4.4 IC4.3 IC4.2 IC4.1 | C10.1 17.62,9.71 | 6.69,13.53 C11.2 6.6,13.44 | 8.6,14.44 C12.2 8.5,14.62 | IC7.26 12.56,10.57 | IC7.7 9.94,3.33 9.94,4.5 v10.25,4.81 | IC7.18 7.35,9.56 | 7.35,9.56 7.35,9.04 v6.56,8.25 | IC7.21 9.3,9.68 9.06,9.44 7.47,9.44 7.35,9.56 | C13.1 51.41,22.1 | C4.1 47.88,16.54 v47.88,16.31 | IC8.53 v14.81,46.12 | IC8.36 IC8.35 15,37.12 v14.94,37.06 | IC8.33 v14.94,36.12 | IC8.29 v14.94,34.12 | IC1.6 v72.12,9.94 | IC8.49 15.31,44.12 v14.88,44.56 | IC8.43 14.88,41.12 v14.75,41.25 | 5.5,57.75 CON6.GND@3 | IC8.25 24.56,35.62 v24.69,35.5
  Bottom 0.28: IC8.5 v22.25,45.62 | IC8.13 v22.5,41.62 | IC8.21 v22.56,37.62
  Bottom 0.3: 51.41,22.1 v52,22.69 | 17.62,9.71 v17.62,10.69 | 6.6,13.44 v5.88,13.44 | 8.5,14.62 v8.5,15.31 | IC7.25 IC7.26 | 12.56,10.57 v12.56,11.88 | 2.37,22.86 4.14,22.86 v4.19,22.81
  Bottom 0.305: R14.2 v80.75,49.62 | C3.- 63.7,43.45 v63.44,43.19 | CON6.3 CON6.4 v1,49.88 | CON6.21 v0.94,32.88 | CON6.18 v1,35.88 | CON6.15 v1.06,38.88 | CON6.12 v1.06,41.88 | CON6.9 v1.06,44.88 | CON6.6 v1.06,47.88 | CON6.GND@1 2.29,53.94 v0.94,53.94 | 5.5,57.75 v7.19,57.75 | CON6.GND@2 2.37,22.86 | CON6.26 v0.94,27.88 | CON6.GND@4 5.38,19.12 v3.5,19.12 | C14.1 41.61,14.94 v41,14.94 | C6.1 45.02,15.4 v45.87,15.4
  Bottom 0.61: C1.- 86.58,24.26 v86.56,24.25 | IC1.2 70.42,26.43 v70.44,26.44 | C2.- 69.7,30.64 v69.69,30.62
  other vias: 73.38,43.06 74.62,43.06 75.94,43.06 77.19,43.06 78.44,43.06 72.06,43.06 70.81,43.06 69.5,43.06 68.25,43.06 70.88,9.94 69.56,9.94 68.31,9.94 67.06,9.94 73.44,9.94 74.69,9.94 76,9.94 77.25,9.94
  pour Route2: 0,60 90,60 90,0 59.69,0 59.62,9.12 48.56,9.12 48.56,6.19 59.25,6.25 59.25,0.12 59.12,-0.06 48.56,0 0,0
  pour Top (no thermals): 67.81,43.62 79.25,43.62 79.31,43.56 79.31,42.25 67.75,42.25 67.75,43.56
  pour Bottom (no thermals): 66.81,10.69 77.69,10.69 77.75,10.62 77.75,9 77.69,8.94 66.81,8.94
HDMI_CLK_N
  Top 0.28: CON2.12 55.38,8.64 55.09,8.93 55.09,9.14 arc39 52.27,17.16 arc8 IC5.94
HDMI_CLK_P
  Top 0.28: CON2.10 54.38,8.65 54.66,8.93 54.65,9.14 arc39 51.92,16.86 arc1 IC5.93
HDMI_DAT0_N
  Top 0.28: CON2.9 53.88,8.72 53.61,8.98 53.61,9.24 53.72,10.21 arc90 52.21,11.71 arc-90 51.59,12.08 51.59,12.26 arc-90 51.59,12.27 51.9,13 arc21 51.37,15.74 arc28 IC5.91
HDMI_DAT0_P
  Top 0.28: CON2.7 52.88,8.69 53.15,8.98 53.26,10.21 arc90 52.21,11.26 arc-90 51.07,12.05 51.1,12.25 arc-90 51.11,12.29 51.4,13.04 arc21 50.95,15.58 arc18 IC5.90
HDMI_DAT1_N
  Top 0.28: CON2.6 52.38,8.67 52.08,8.97 52.08,9.51 52.08,9.57 arc90 51.09,10.74 49.73,10.65 arc-93 49.13,11.05 arc-82 49.36,12 arc113 49.68,14.28 arc-20 IC5.86
HDMI_DAT1_P
  Top 0.28: IC5.85 arc16 49.43,13.8 arc-111 49.27,12.52 arc82 48.66,10.94 arc83 49.77,10.17 50.99,10.27 arc-90 51.63,9.73 51.63,9.51 51.63,8.97 51.38,8.72 CON2.4
HDMI_DAT2_N
  Top 0.28: CON2.3 50.88,8.59 arc90 49.9,9.48 47.14,9.04 arc-42 46.3,9.29 arc-97 46.64,10.34 arc55 47.81,11.81 arc44 47.59,12.68 IC5.81
HDMI_DAT2_P
  Top 0.28: CON2.1 49.88,7.71 49.88,8.49 arc90 49.26,8.91 47.21,8.54 arc-42 45.97,8.88 arc-97 46.29,10.7 arc55 47.32,11.84 arc44 47.23,12.3 arc14 IC5.80
  Top 0.3: CON2.1
HDMI_OCK_INV
  Top 0.305: IC5.100 53.66,20.09 56.5,17.25 57.23,17.25 JP1.2 57.9,17.92 R6.1
HDMI_PIXS
  Top 0.305: IC5.4 53.61,25 56.38,25 59.85,21.52 R5.1 59.85,17.92 JP2.2
INT_RGB_DE
  Top 0.15: IC5.46 33.52,26.07 R2.3M
INT_RGB_EVEN_B0  (via drill 0.3)
  Top 0.15: R3.4M 37.74,37.76 v37.81,37.75 | IC5.10 52.69,28.32 52.69,35.94 50.88,37.75 v49.69,37.75
  Bottom 0.15: v37.81,37.75 v49.69,37.75
INT_RGB_EVEN_B1  (via drill 0.3)
  Top 0.15: R3.3M 37.73,36.96 v37.81,36.94 | IC5.11 52,28.34 52,35.44 50.5,36.94 v49.62,36.94
  Bottom 0.15: v37.81,36.94 v49.62,36.94
INT_RGB_EVEN_B2  (via drill 0.3)
  Top 0.15: R3.2M 37.71,36.16 v37.81,36.12 | IC5.12 51.38,28.42 51.38,34.75 50,36.12 v49.44,36.12
  Bottom 0.15: v37.81,36.12 v49.44,36.12
INT_RGB_EVEN_B3  (via drill 0.3)
  Top 0.15: R3.1M 37.76,35.36 v37.81,35.31 | IC5.13 50.81,28.56 50.81,34.19 49.69,35.31 v49.31,35.31
  Bottom 0.15: v37.81,35.31 v49.31,35.31
INT_RGB_EVEN_B4  (via drill 0.3)
  Top 0.15: IC5.14 48.12,26.58 48.12,26.38 v47.88,26.12 | R8.4M 36.98,33.09 v37.69,32.38
  Bottom 0.15: v37.69,32.38 42.06,28 45.25,28 47.19,26.06 47.81,26.06 v47.88,26.12
INT_RGB_EVEN_B5  (via drill 0.3)
  Top 0.15: IC5.15 46.84,26 46.25,26 v46.19,26.06 | R8.3M 36.41,32.53 v37.12,31.81
  Bottom 0.15: v37.12,31.81 41.38,27.56 44.69,27.56 v46.19,26.06
INT_RGB_EVEN_B6  (via drill 0.3)
  Top 0.15: IC5.16 48.35,28.1 46.94,26.69 45.69,26.69 45.12,26.12 v44.88,26.12 | R8.2M 35.84,31.91 v36.5,31.25
  Bottom 0.15: v44.88,26.12 44.75,26.12 43.94,26.94 40.81,26.94 v36.5,31.25
INT_RGB_EVEN_B7  (via drill 0.3)
  Top 0.15: IC5.17 47.95,28.57 46.5,27.12 44.88,27.12 43.88,26.12 v43.69,26.12 | R8.1M 35.28,31.28 v35.88,30.69
  Bottom 0.15: v43.69,26.12 40.44,26.12 v35.88,30.69
INT_RGB_EVEN_G0  (via drill 0.3)
  Top 0.15: R9.4M 37.05,44.83 v37.06,44.81 | IC5.20 46.93,29.68 48.62,31.38 48.62,43 v46.81,44.81
  Bottom 0.15: v37.06,44.81 v46.81,44.81
INT_RGB_EVEN_G1  (via drill 0.3)
  Top 0.15: R9.3M 37.04,44.02 v37.06,44 | IC5.21 46.58,30.02 48.12,31.56 48.12,42 v46.12,44
  Bottom 0.15: v37.06,44 v46.12,44
INT_RGB_EVEN_G2  (via drill 0.3)
  Top 0.15: R9.2M 37.02,43.23 v37.06,43.19 | IC5.22 47.56,31.69 47.56,41.12 v45.5,43.19
  Bottom 0.15: v37.06,43.19 v45.5,43.19
INT_RGB_EVEN_G3  (via drill 0.3)
  Top 0.15: R9.1M 37.01,42.42 v37.06,42.38 | IC5.23 47,31.82 47,40 v44.62,42.38
  Bottom 0.15: v37.06,42.38 v44.62,42.38
INT_RGB_EVEN_G4  (via drill 0.3)
  Top 0.15: R10.4M 37.11,41.33 v37.12,41.31 | IC5.24 46.44,31.97 46.44,39.25 44.38,41.31 v43.75,41.31
  Bottom 0.15: v37.12,41.31 v43.75,41.31
INT_RGB_EVEN_G5  (via drill 0.3)
  Top 0.15: R10.3M 37.1,40.52 v37.12,40.5 | IC5.25 45.16,31.41 45.94,32.19 45.94,38.69 44.12,40.5 v43.06,40.5
  Bottom 0.15: v37.12,40.5 v43.06,40.5
INT_RGB_EVEN_G6  (via drill 0.3)
  Top 0.15: R10.2M 37.15,39.73 v37.19,39.69 | IC5.26 42.34,31.41 41.38,32.38 41.38,32.75 43.06,34.44 43.06,39.12 v42.5,39.69
  Bottom 0.15: v37.19,39.69 v42.5,39.69
INT_RGB_EVEN_G7  (via drill 0.3)
  Top 0.15: R10.1M 37.24,38.92 v37.25,38.94 | IC5.27 41.38,31.65 41.38,31.69 40.94,32.12 40.94,33 42.31,34.38 42.31,38.75 v42.06,39
  Bottom 0.15: v37.25,38.94 v42.06,39
INT_RGB_EVEN_R0
  Top 0.15: IC5.30 40.19,30.72 40.19,30.88 40.5,31.19 40.5,33.81 41.12,34.44 41.12,50.12 39.5,51.75 37.31,51.75 R11.4M
INT_RGB_EVEN_R1
  Top 0.15: IC5.31 39.69,30.51 39.69,30.81 40.19,31.31 40.19,33.94 40.81,34.56 40.81,49.69 39.44,51.06 37.27,51.06 R11.3M
INT_RGB_EVEN_R2
  Top 0.15: IC5.32 39.25,30.24 39.25,30.81 39.88,31.44 39.88,34.06 40.5,34.69 40.5,49.06 39.31,50.25 37.26,50.25 R11.2M
INT_RGB_EVEN_R3
  Top 0.15: IC5.33 39.86,28.95 38.81,30 38.81,30.81 39.56,31.56 39.56,34.19 40.19,34.81 40.19,48.62 39.38,49.44 37.25,49.44 R11.1M
INT_RGB_EVEN_R4
  Top 0.15: IC5.34 39.49,28.57 38.44,29.62 38.44,30.88 39.25,31.69 39.25,34.31 39.88,34.94 39.88,47.38 38.88,48.38 37.29,48.38 R12.4M
INT_RGB_EVEN_R5
  Top 0.15: IC5.35 38.06,29.31 38.06,30.94 38.94,31.81 38.94,34.5 39.56,35.12 39.56,46.56 38.56,47.56 37.27,47.56 R12.3M
INT_RGB_EVEN_R6
  Top 0.15: IC5.36 37.69,28.98 37.69,31 38.56,31.88 38.56,34.62 39.25,35.31 39.25,45.75 38.25,46.75 37.26,46.75 R12.2M
INT_RGB_EVEN_R7
  Top 0.15: IC5.37 37.31,28.64 37.31,31.12 38.25,32.06 38.25,34.75 38.94,35.44 38.94,44.81 37.88,45.88 37.29,45.88 R12.1M
INT_RGB_HSYNC
  Top 0.15: IC5.47 32.73,26.16 R2.2M
INT_RGB_ODCK
  Top 0.15: IC5.44 34.49,26.51 R2.4M
INT_RGB_VSYNC
  Top 0.15: IC5.48 33.05,25.12 32.38,25.12 31.93,25.57 R2.1M
LVDS_0_N
  Bottom 0.28: IC8.48 14.31,43.62 arc-90 12.12,45.45 arc90 9.77,47.79 8.33,47.79 arc25 3.93,46.81 arc-56 CON6.7
LVDS_0_P
  Bottom 0.28: IC8.47 14.36,43.12 arc-90 11.66,45.45 arc90 9.77,47.34 8.33,47.34 arc25 4.12,46.4 arc-18 CON6.8
LVDS_1_N
  Bottom 0.28: IC8.46 12.01,42.62 arc-90 11.21,43.42 arc90 9.51,45.16 8.27,45.16 arc90 7.33,44.18 7.33,43.94 arc-90 6.93,43.55 3.41,43.55 arc-35 CON6.10
LVDS_1_P
  Bottom 0.28: IC8.45 12.06,42.12 arc-90 10.77,43.42 arc90 9.51,44.71 8.27,44.71 arc90 7.78,44.22 7.78,43.94 arc-90 6.93,43.09 3.41,43.09 arc23 CON6.11
LVDS_2_N
  Bottom 0.28: IC8.42 11.43,40.62 arc90 9.52,39.1 9.51,38.98 arc-90 8.51,38.31 8.09,38.31 arc-90 7.39,39.01 arc90 5.46,40.57 3.44,40.57 arc-32 CON6.13
LVDS_2_P
  Bottom 0.28: IC8.41 11.38,40.12 arc90 9.97,39.1 9.96,38.98 arc-90 8.51,37.86 8.09,37.86 arc-90 6.94,39.01 arc90 5.46,40.12 3.44,40.12 arc25 CON6.14
LVDS_3_N
  Bottom 0.28: IC8.38 14.46,38.62 arc90 12.34,36.5 arc-90 8.85,34.03 3.56,34.54 arc-31 CON6.19
LVDS_3_P
  Bottom 0.28: IC8.37 14.41,38.12 arc90 12.79,36.5 arc-90 8.85,33.58 3.56,34.09 arc20 CON6.20
LVDS_CLK_N
  Bottom 0.28: IC8.40 13.45,39.62 arc90 10.76,37.11 arc-90 9.85,36.27 6.23,36.27 arc-90 5.78,36.7 arc90 4.71,37.57 3.46,37.57 arc-30 CON6.16
LVDS_CLK_P
  Bottom 0.28: IC8.39 13.4,39.12 arc90 11.21,37.11 arc-90 9.85,35.82 6.23,35.82 arc-90 5.33,36.69 arc90 4.71,37.12 3.46,37.12 arc25 CON6.17
LVDS_LED_EN  (via drill 0.3)
  Top 0.15: JP8.2 14.58,23.21 R4.1 13.25,25.12 v11.38,27
  Bottom 0.15: CON6.25 9.5,28.88 v11.38,27
LVDS_PWM  (via drill 0.3)
  Top 0.15: JP6.3 20.38,18.81 19.44,19.75 19.44,24.69 v17.06,27.06
  Bottom 0.15: CON6.24 14.25,29.88 v17.06,27.06
LVDS_REVSCAN  (via drill 0.3)
  Top 0.15: v11.94,19.62 12.1,19.46 12.1,18.84 12.81,18.12 13.35,18.12 R18.1 14.52,18.1 JP7.2 | v0.69,48.88 0.38,48.56 0.38,30.94 8.75,22.56 v9.56,22.56
  Bottom 0.15: v0.69,48.88 CON6.5 | v11.94,19.62 11.94,20.19 v9.56,22.56
N$1
  Top 0.406: LED1.A R24.2
N$2
  Top 1.27: CON1.3 79.51,4.76 84,9.25 84,15.09 T1.2
N$4
  Top 0.6: D1.A 88.34,31.38 R1.2
  Top 1.016: D1.A 86.67,27.4 T1.1
N$5  (via drill 0.3)
  Top 0.15: 2.6,10.22 v2.94,10.56 1.44,9.06 R22.2
  Bottom 0.15: v2.94,10.56 IC7.15
N$6
  Top 0.406: LED2.A R25.2
N$7
  Top 0.406: LED3.A R26.2
N$8
  Top 0.406: LED4.A R27.2
N$10  (via drill 0.3)
  Top 0.15: 3.25,9.69 v3.5,9.94 2.75,9.19 R23.2
  Bottom 0.15: v3.5,9.94 4.5,9.94 5.25,9.19 5.62,9.19 6,9.56 6,10.51 IC7.16
N$18
  Top 0.305: CON2.19 58.88,8.38 59.12,8.62 59.85,8.62 R7.1
N$35
  Bottom 0.406: R13.1 78.62,49.6 R14.1 76.66,49.62 IC3.1
N$37  (via drill 0.3)
  Top 0.3: CON3.2 29.88,48.62 29.62,48.88 29.62,49.44 33.44,53.25 v34.81,53.25
  Bottom 0.3: v34.81,53.25 57.19,53.25 59.88,50.56 59.88,48.98 T2.2
N$57
  Bottom 1.016: R20.1 R21.1 63.77,48 T2.3
RGB_DE  (via drill 0.3)
  Top 0.15: CON3.34 | v29.5,32.62 CON3.34 | CON3.34 31.88,32.62 v32.06,32.44 | v33.56,30.5 33.56,28.15 R2.3P
  Bottom 0.15: v29.5,32.62 19,32.62 17,34.62 IC8.30 | v32.06,32.44 32.06,32 v33.56,30.5
RGB_DISP  (via drill 0.3)
  Top 0.15: 63.06,19.34 R15.1 62.98,19.65 v58,24.62 | 30.88,34.06 CON3.31 30.31,34.12 30,34.44 28.75,34.44 27.94,33.5 v27.94,31.94
  Top 0.305: R15.1 62.98,17.92 JP3.2
  Bottom 0.15: v27.94,31.94 27.94,31.12 36.94,22.12 39.44,22.12 41.94,24.62 v58,24.62
RGB_EVEN_B0  (via drill 0.3)
  Top 0.15: R3.4P 34.17,37.76 32.88,39.06 31,39.06 CON3.21 29.75,39.13 v29.56,39.31
  Bottom 0.15: IC8.15 24.69,40.62 25.69,39.62 29.25,39.62 v29.56,39.31
RGB_EVEN_B1  (via drill 0.3)
  Top 0.15: R3.3P 34.35,36.96 32.75,38.56 31,38.56 CON3.22 29.87,38.63 29.75,38.75 28.56,38.75 v28.25,39.06
  Bottom 0.15: v28.25,39.06 25.81,39.06 25.25,38.5 24.5,38.5 24.38,38.62 IC8.19
RGB_EVEN_B2  (via drill 0.3)
  Top 0.15: R3.2P 34.46,36.16 32.56,38.06 31,38.06 CON3.23 29.94,38.12 29.69,38.38 28.19,38.38 28.06,38.5 v27.56,38.5
  Bottom 0.15: IC8.20 25.81,38.12 26.19,38.5 v27.56,38.5
RGB_EVEN_B3  (via drill 0.3)
  Top 0.15: R3.1P 34.64,35.36 32.44,37.56 31,37.56 CON3.24 30,37.62 29.69,37.94 28.06,37.94 v27.94,37.81
  Bottom 0.15: IC8.22 24.5,37.12 25,37.62 27.75,37.62 v27.94,37.81
RGB_EVEN_B4  (via drill 0.3)
  Top 0.15: v29.31,37.38 29.56,37.13 CON3.25 31,37.06 32.38,37.06 34.69,34.75 35.38,34.75 R8.4P
  Bottom 0.15: IC8.23 24.56,36.62 25.06,37.12 28.12,37.12 28.5,37.5 29.19,37.5 v29.31,37.38
RGB_EVEN_B5  (via drill 0.3)
  Top 0.15: v28.75,36.75 28.88,36.62 CON3.26 32.25,36.62 34.75,34.12 34.88,34.12 R8.3P
  Bottom 0.15: IC8.24 24.56,36.12 25.06,36.62 28.62,36.62 v28.75,36.75
RGB_EVEN_B6  (via drill 0.3)
  Top 0.15: v24.5,40 24.69,39.81 25,39.81 27.88,36.94 27.88,36.56 28.31,36.13 CON3.27 31,36.06 32.25,36.06 33.94,34.38 33.94,33.93 R8.2P
  Bottom 0.15: v24.5,40 24.5,40.06 24.44,40.12 IC8.16
RGB_EVEN_B7  (via drill 0.3)
  Top 0.15: v24.88,39.12 28.38,35.62 CON3.28 32.06,35.62 33.62,34.06 33.62,33.12 R8.1P
  Bottom 0.15: v24.88,39.12 IC8.18
RGB_EVEN_G0  (via drill 0.3)
  Top 0.15: R9.4P 34.44,44.75 33.56,44.75 31.94,43.12 CON3.13 30.88,43.19 29.12,43.19 28.94,43.38 28.25,43.38 28.06,43.19 27.69,43.19 26.94,43.94 v26.88,43.94
  Bottom 0.15: IC8.4 24.75,46.12 26.88,44 v26.88,43.94
RGB_EVEN_G1  (via drill 0.3)
  Top 0.15: CON3.14 | R9.3P 34.49,44 33.38,44 32,42.62 CON3.14 | CON3.14 30.25,42.62 30,42.88 29.12,42.88 29,42.75 v28.62,42.75
  Bottom 0.15: IC8.6 24.81,45.12 27.19,42.75 v28.62,42.75
RGB_EVEN_G2  (via drill 0.3)
  Top 0.15: R9.2P 34.48,43.19 33.12,43.19 32.06,42.12 CON3.15 29.75,42.13 v29.56,42.31
  Bottom 0.15: IC8.7 24.62,44.62 26.94,42.31 28.25,42.31 28.44,42.12 29.12,42.12 29.31,42.31 v29.56,42.31
RGB_EVEN_G3  (via drill 0.3)
  Top 0.15: R9.1P 34.46,42.38 32.94,42.38 32.19,41.62 CON3.16 29.93,41.63 29.81,41.75 v28.06,41.75
  Bottom 0.15: IC8.11 25.44,42.62 26.31,41.75 v28.06,41.75
RGB_EVEN_G4  (via drill 0.3)
  Top 0.15: R10.4P 34.5,41.31 32.75,41.31 32.56,41.12 CON3.17 29.5,41.13 v29.44,41.19
  Bottom 0.15: IC8.12 25.12,42.12 25.69,41.56 26.06,41.19 26.12,41.12 28.19,41.12 28.44,41.38 29.25,41.38 v29.44,41.19
RGB_EVEN_G5  (via drill 0.3)
  Top 0.15: R10.3P 33.35,40.52 33.25,40.62 CON3.18 28.75,40.62 v28.69,40.69
  Bottom 0.15: IC8.14 25.19,41.12 25.62,40.69 v28.69,40.69
RGB_EVEN_G6  (via drill 0.3)
  Top 0.15: R10.2P 33.52,39.73 33.12,40.12 CON3.19 30.25,40.12 30.12,40.25 29.06,40.25 28.94,40.12 27.81,40.12 27.5,40.44 27.5,41.81 25.38,43.94 24.56,43.94 v24.5,44
  Bottom 0.15: v24.5,44 24.38,44.12 IC8.8
RGB_EVEN_G7  (via drill 0.3)
  Top 0.15: R10.1P 33.64,38.92 32.94,39.62 CON3.20 30.94,39.64 30.17,39.64 29.94,39.88 29.12,39.88 29,39.75 26.88,39.75 26.56,40.06 26.56,41.56 v24.94,43.19
  Bottom 0.15: v24.94,43.19 23.6,43.19 IC8.10
RGB_EVEN_R0  (via drill 0.3)
  Top 0.15: R11.4P 35.26,51.83 33.62,50.19 33.62,48.44 32.31,47.12 CON3.5 29.81,47.12 v29.56,47.38
  Bottom 0.15: v29.56,47.38 28.56,47.38 26.19,49.75 16.06,49.75 13.62,47.31 13.62,45.5 14,45.12 IC8.51
RGB_EVEN_R1  (via drill 0.3)
  Top 0.15: R11.3P 34.96,51.02 33.94,50 33.94,48.31 32.25,46.62 CON3.6 29.06,46.62 v28.88,46.81
  Bottom 0.15: IC8.52 15.25,45.62 15.12,45.5 14.31,45.5 14.06,45.75 14.06,47.31 15.19,48.44 19.25,48.44 19.69,48 20.62,48 21.38,48.75 26.62,48.75 28.56,46.81 v28.88,46.81
RGB_EVEN_R2  (via drill 0.3)
  Top 0.15: R11.2P 34.79,50.23 34.25,49.69 34.25,48.19 32.19,46.12 CON3.7 29.25,46.12 29.12,46.25 28.56,46.25 28.19,46.62 v27.62,46.62
  Bottom 0.15: IC8.54 15.12,46.62 14.81,46.94 14.81,47.56 15.38,48.12 19,48.12 19.5,47.62 20.94,47.62 21.69,48.38 25.88,48.38 v27.62,46.62
RGB_EVEN_R3  (via drill 0.3)
  Top 0.15: R11.1P 34.99,49.42 34.56,49 34.56,48.06 32.12,45.62 CON3.8 30.25,45.62 30.06,45.81 v28,45.81
  Route15 0.15: v17.5,46.88 17.75,46.88 18,47.12 21.5,47.12 21.75,46.88 23.19,46.88 23.38,47.06 24,47.06 25.25,45.81 v28,45.81
  Bottom 0.15: v17.5,46.88 17.25,47.12 IC8.55
RGB_EVEN_R4  (via drill 0.3)
  Top 0.15: R12.4P 35.26,48.33 32.06,45.12 CON3.9 30.88,45.19 29.56,45.19 v29.5,45.25
  Route15 0.15: v18.12,46.38 18.19,46.44 23.94,46.44 25.12,45.25 v29.5,45.25
  Bottom 0.15: v18.12,46.38 18.12,47.25 17.75,47.62 IC8.56
RGB_EVEN_R5  (via drill 0.3)
  Top 0.15: 35.6,47.56 R12.3P 34.9,47.52 32,44.62 CON3.10 30.88,44.69 v28.56,44.69
  Bottom 0.15: IC8.3 25.06,46.62 27.06,44.62 28.5,44.62 v28.56,44.69
RGB_EVEN_R6  (via drill 0.3)
  Top 0.15: R12.2P 35.61,46.75 34.56,46.75 31.94,44.12 CON3.11 v29.44,44.12 v29.44,44.11 | v27.94,43.81 26.69,45.06 17.62,45.06 v17.19,44.62
  Bottom 0.15: v29.44,44.12 28.44,44.12 28.12,43.81 v27.94,43.81 | v17.19,44.62 IC8.50
RGB_EVEN_R7  (via drill 0.3)
  Top 0.15: R12.1P 35.62,45.94 34.25,45.94 31.94,43.62 CON3.12 29.94,43.62 29.88,43.56 29.19,43.56 28.88,43.88 28.62,43.88 25.31,47.19 v25.19,47.19
  Bottom 0.15: 23.6,47.06 IC8.2 25.12,47.12 v25.19,47.19
RGB_HSYNC  (via drill 0.3)
  Top 0.15: CON3.32 | CON3.32 32.31,33.62 32.94,33 32.94,29 32.75,28.81 32.75,28.14 R2.2P | CON3.32 29.88,33.62 v29.62,33.88
  Bottom 0.15: IC8.27 28.88,34.62 v29.62,33.88
RGB_ODCK
  Top 0.15: CON3.30 32.38,34.62 33.25,33.75 33.25,32.12 34.31,31.06 34.31,28.12 R2.4P
RGB_PWM
  Top 0.15: JP4.3 JP6.1
RGB_PWM_EN  (via drill 0.3)
  Top 0.15: v36.31,21.62 v30.06,21.62
  Bottom 0.15: JP4.2 25.44,20.75 29.19,20.75 v30.06,21.62 | v36.31,21.62 36.69,21.25 55.88,21.25 61.75,27.12 61.75,43.31 59.9,45.16 T2.1
RGB_VSYNC  (via drill 0.3)
  Top 0.15: CON3.33 | CON3.33 32.31,33.12 32.62,32.81 32.62,29.94 31.94,29.25 31.94,28.12 R2.1P | CON3.33 29.81,33.12 29.69,33.25 28.94,33.25 v28.81,33.38
  Bottom 0.15: IC8.28 28.06,34.12 v28.81,33.38
USB_D+
  Top 0.15: CON4.3 9.5,8.62 9.06,9.06 3.94,9.06 3.56,8.69 3.56,6.75 3.35,6.54 R23.1
USB_D-
  Top 0.15: CON4.2 8.62,6.79 8.62,5.38 8.44,5.19 2,5.19 1.38,5.81 1.38,6.47 R22.1

## Text on the board
Top: HDMI_RGB_LVDS V4 | Armin Schlegel | 27.03.2014 | 1
Route2: 2
Route15: 3
Bottom: 4